# Altium project ADCS.PrjPcb
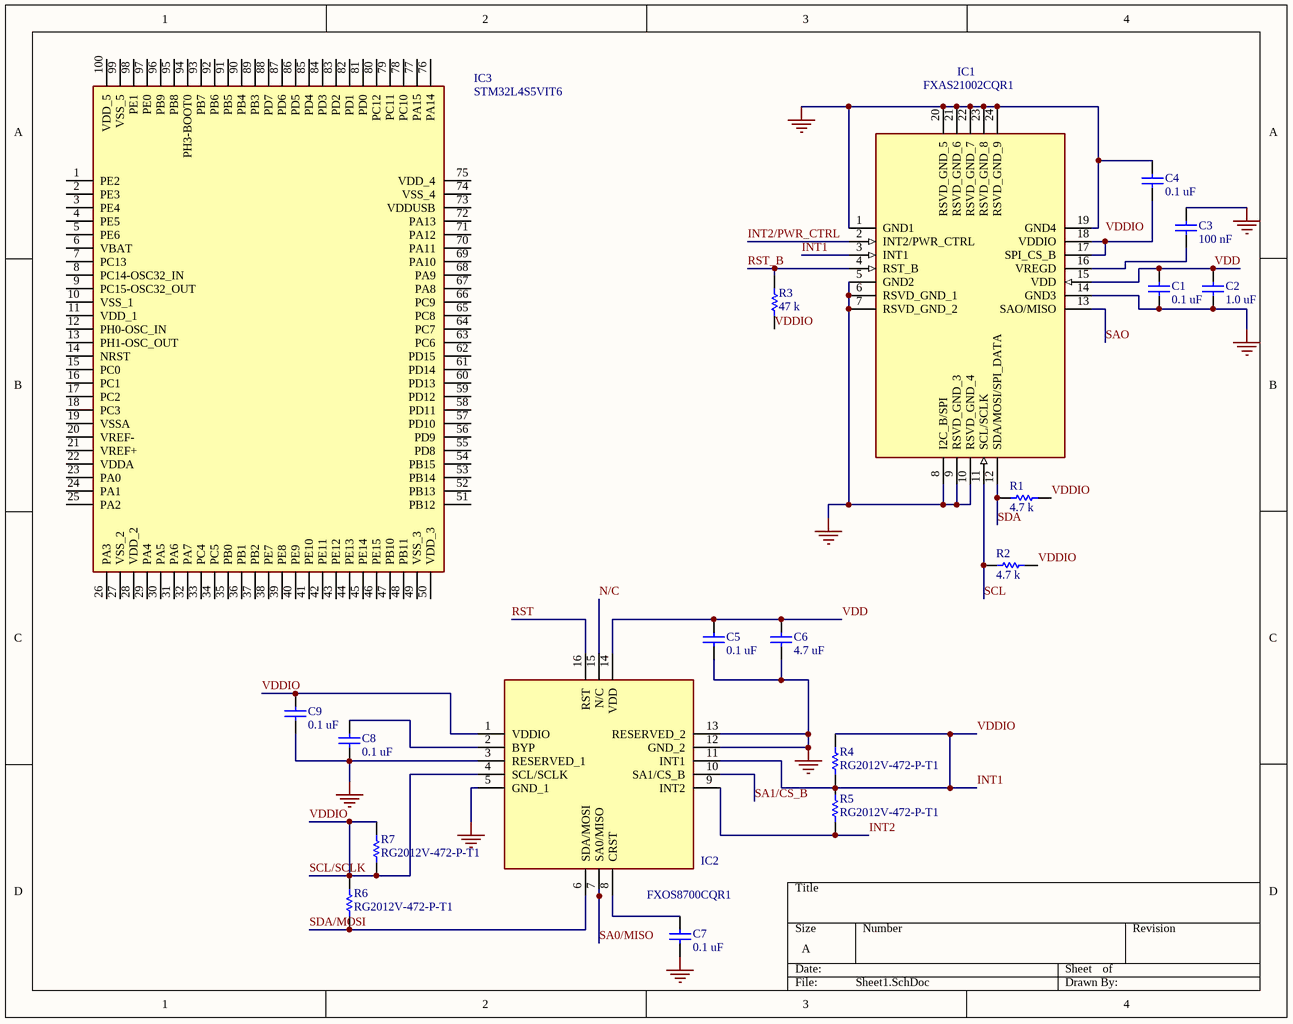
[diagram p0: Sheet1.SchDoc]
1 sheet, 19 parts. Net scope: global (net labels, ports and power ports of the same name join across sheets).
Board file: PCB1.PcbDoc

## Sheet Sheet1.SchDoc
size A

### Parts
C1  0.1 uF  [CAPC1005X55X30ML05T10]
C2  1.0 uF  [CAPC1005X55X30ML05T10]
C3  100 nF  [CAPC1005X55X30ML05T10]
C4  0.1 uF  [CAPC1005X55X30ML05T10]
C5  0.1 uF  [CAPC1005X55X30ML05T10]
C6  4.7 uF  [CAPC1005X55X30ML05T10]
C7  0.1 uF  [CAPC1005X55X30ML05T10]
C8  0.1 uF  [CAPC1005X55X30ML05T10]
C9  0.1 uF  [CAPC1005X55X30ML05T10]
IC1  FXAS21002CQR1  [FXAS21002CQR1]
IC2  FXOS8700CQR1  [MMA8452QT]
IC3  STM32L4S5VIT6  [QFP50P1600X1600X160-100N]
R1  4.7 k  [RESC2013X50X40LL20T20]
R2  4.7 k  [RESC2013X50X40LL20T20]
R3  47 k  [RESC2013X50X40ML20T20]
R4  RG2012V-472-P-T1  [RESC2013X50X40LL20T20]
R5  RG2012V-472-P-T1  [RESC2013X50X40LL20T20]
R6  RG2012V-472-P-T1  [RESC2013X50X40LL20T20]
R7  RG2012V-472-P-T1  [RESC2013X50X40LL20T20]

### Nets
GND: C1.1 C2.1 C3.2 C4.1 C5.1 C6.1 C7.1 C8.1 C9.1 IC1.1(GND1) IC1.5(GND2) IC1.6(RSVD_GND_1) IC1.7(RSVD_GND_2) IC1.8(I2C_B/SPI) IC1.9(RSVD_GND_3) IC1.10(RSVD_GND_4) IC1.14(GND3) IC1.19(GND4) IC1.20(RSVD_GND_5) IC1.21(RSVD_GND_6) IC1.22(RSVD_GND_7) IC1.23(RSVD_GND_8) IC1.24(RSVD_GND_9) IC2.3(RESERVED_1) IC2.5(GND_1) IC2.12(GND_2) IC2.13(RESERVED_2)
INT1: C9.2 IC1.3(INT1) IC2.1(VDDIO) IC2.4(SCL/SCLK) IC2.11(INT1) R1.2 R2.2 R3.1 R4.1 R4.2 R6.2 R7.1 R7.2  [also labelled SCL/SCLK, VDDIO]
INT2: IC2.9(INT2) R5.1
INT2/PWR_CTRL: IC1.2(INT2/PWR_CTRL)
N/C: IC2.15(N/C)
RST: IC2.16(RST)
RST_B: IC1.4(RST_B) R3.2
SA0/MISO: IC2.7(SA0/MISO)
SA1/CS_B: IC2.10(SA1/CS_B)
SAO: IC1.13(SAO/MISO)
SCL: IC1.11(SCL/SCLK) R2.1
SDA: IC1.12(SDA/MOSI/SPI_DATA) R1.1
SDA/MOSI: IC2.6(SDA/MOSI) R6.1
VDD: C1.2 C2.2 C5.2 C6.2 IC1.15(VDD) IC2.14(VDD)
NetC3_1: C3.1 IC1.16(VREGD)
NetC4_2: C4.2 IC1.17(SPI_CS_B) IC1.18(VDDIO)
NetC7_2: C7.2 IC2.8(CRST)
NetC8_2: C8.2 IC2.2(BYP)

Not connected (* = marked no-connect by the designer): IC3 1(PE2) 2(PE3) 3(PE4) 4(PE5) 5(PE6) 6(VBAT) 7(PC13) 8(PC14-OSC32_IN) 9(PC15-OSC32_OUT) 10(VSS_1) 11(VDD_1) 12(PH0-OSC_IN) 13(PH1-OSC_OUT) 14(NRST) 15(PC0) 16(PC1) 17(PC2) 18(PC3) 19(VSSA) 20(VREF-) 21(VREF+) 22(VDDA) 23(PA0) 24(PA1) 25(PA2) 26(PA3) 27(VSS_2) 28(VDD_2) 29(PA4) 30(PA5) 31(PA6) 32(PA7) 33(PC4) 34(PC5) 35(PB0) 36(PB1) 37(PB2) 38(PE7) 39(PE8) 40(PE9) 41(PE10) 42(PE11) 43(PE12) 44(PE13) 45(PE14) 46(PE15) 47(PB10) 48(PB11) 49(VSS_3) 50(VDD_3) 51(PB12) 52(PB13) 53(PB14) 54(PB15) 55(PD8) 56(PD9) 57(PD10) 58(PD11) 59(PD12) 60(PD13) 61(PD14) 62(PD15) 63(PC6) 64(PC7) 65(PC8) 66(PC9) 67(PA8) 68(PA9) 69(PA10) 70(PA11) 71(PA12) 72(PA13) 73(VDDUSB) 74(VSS_4) 75(VDD_4) 76(PA14) 77(PA15) 78(PC10) 79(PC11) 80(PC12) 81(PD0) 82(PD1) 83(PD2) 84(PD3) 85(PD4) 86(PD5) 87(PD6) 88(PD7) 89(PB3) 90(PB4) 91(PB5) 92(PB6) 93(PB7) 94(PH3-BOOT0) 95(PB8) 96(PB9) 97(PE0) 98(PE1) 99(VSS_5) 100(VDD_5); R5 2

### Notes on the sheet
- Labels drawn without touching a wire or pin: VDDIO

### Library data of the parts
C1-C9 = CMP-2008-03080-1: Manufacturer: Kemet; Part Number: C0402C104J4RACTU
IC1 = FXAS21002CQR1: Integrated Circuit; Manufacturer_Name: Nexperia; Datasheet Link: http://www.mouser.com/ds/2/302/FXAS21002-783424.pdf; Manufacturer_Part_Number: FXAS21002CQR1; Mouser Part Number: 841-FXAS21002CQR1; Mouser Price/Stock: https://www.mouser.com/Search/Refine.aspx?Keyword=841-FXAS21002CQR1
IC2 = FXOS8700CQR1: Accelerometer; Manufacturer_Name: Nexperia; Datasheet Link: http://cache.nxp.com/files/shared/doc/package_info/98ASA00318D.pdf; Height: 1mm; Manufacturer_Part_Number: FXOS8700CQR1; Mouser Part Number: 841-FXOS8700CQR1; Mouser Price/Stock: https://www.mouser.com/Search/Refine.aspx?Keyword=841-FXOS8700CQR1
IC3 = STM32L4S5VIT6: Integrated Circuit; Manufacturer_Name: STMicroelectronics; Datasheet Link: https://www.mouser.com/datasheet/2/389/stm32l4s5ai-1309291.pdf; Height: 1.6mm; Manufacturer_Part_Number: STM32L4S5VIT6; Mouser Part Number: 511-STM32L4S5VIT6; Mouser Price/Stock: https://www.mouser.com/Search/Refine.aspx?Keyword=511-STM32L4S5VIT6; RS Part Number: 1750803P; RS Price/Stock: http://uk.rs-online.com/web/p/products/1750803P
R1 R2 = CMP-2001-03128-1: Part Number: RG2012V-472-P-T1; Manufacturer: Susumu
R3 = CMP-2001-02983-1: Part Number: RG2012P-473-B-T5; Manufacturer: Susumu
R4-R7 = CMP-2001-03128-1: Manufacturer: Susumu; Part Number: RG2012V-472-P-T1